# EAGLE design newew (EAGLE 7.6.0)
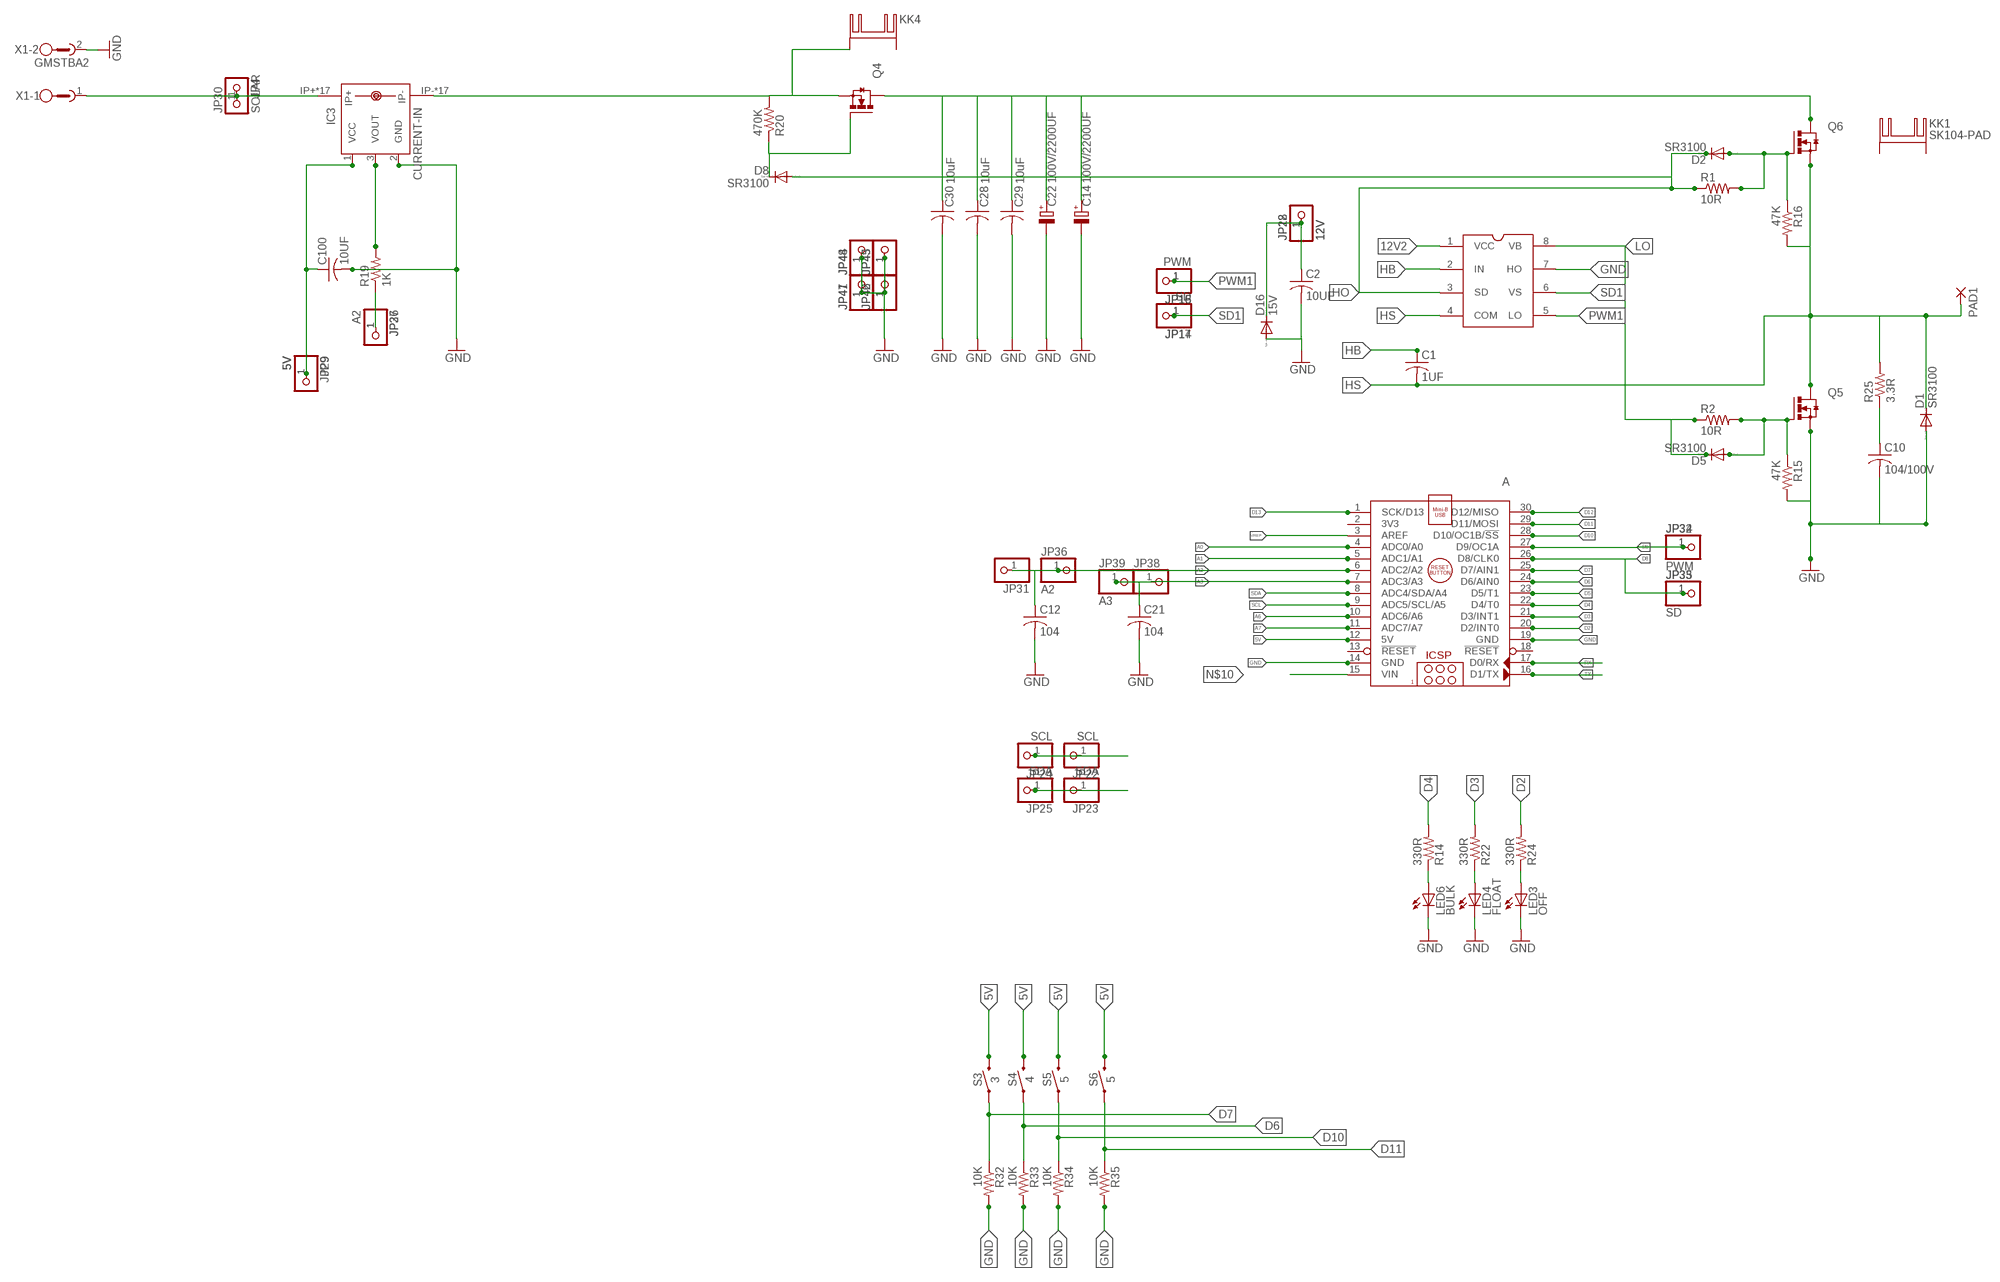
[diagram p0: schematic, sheet 1, part 1 of 2]
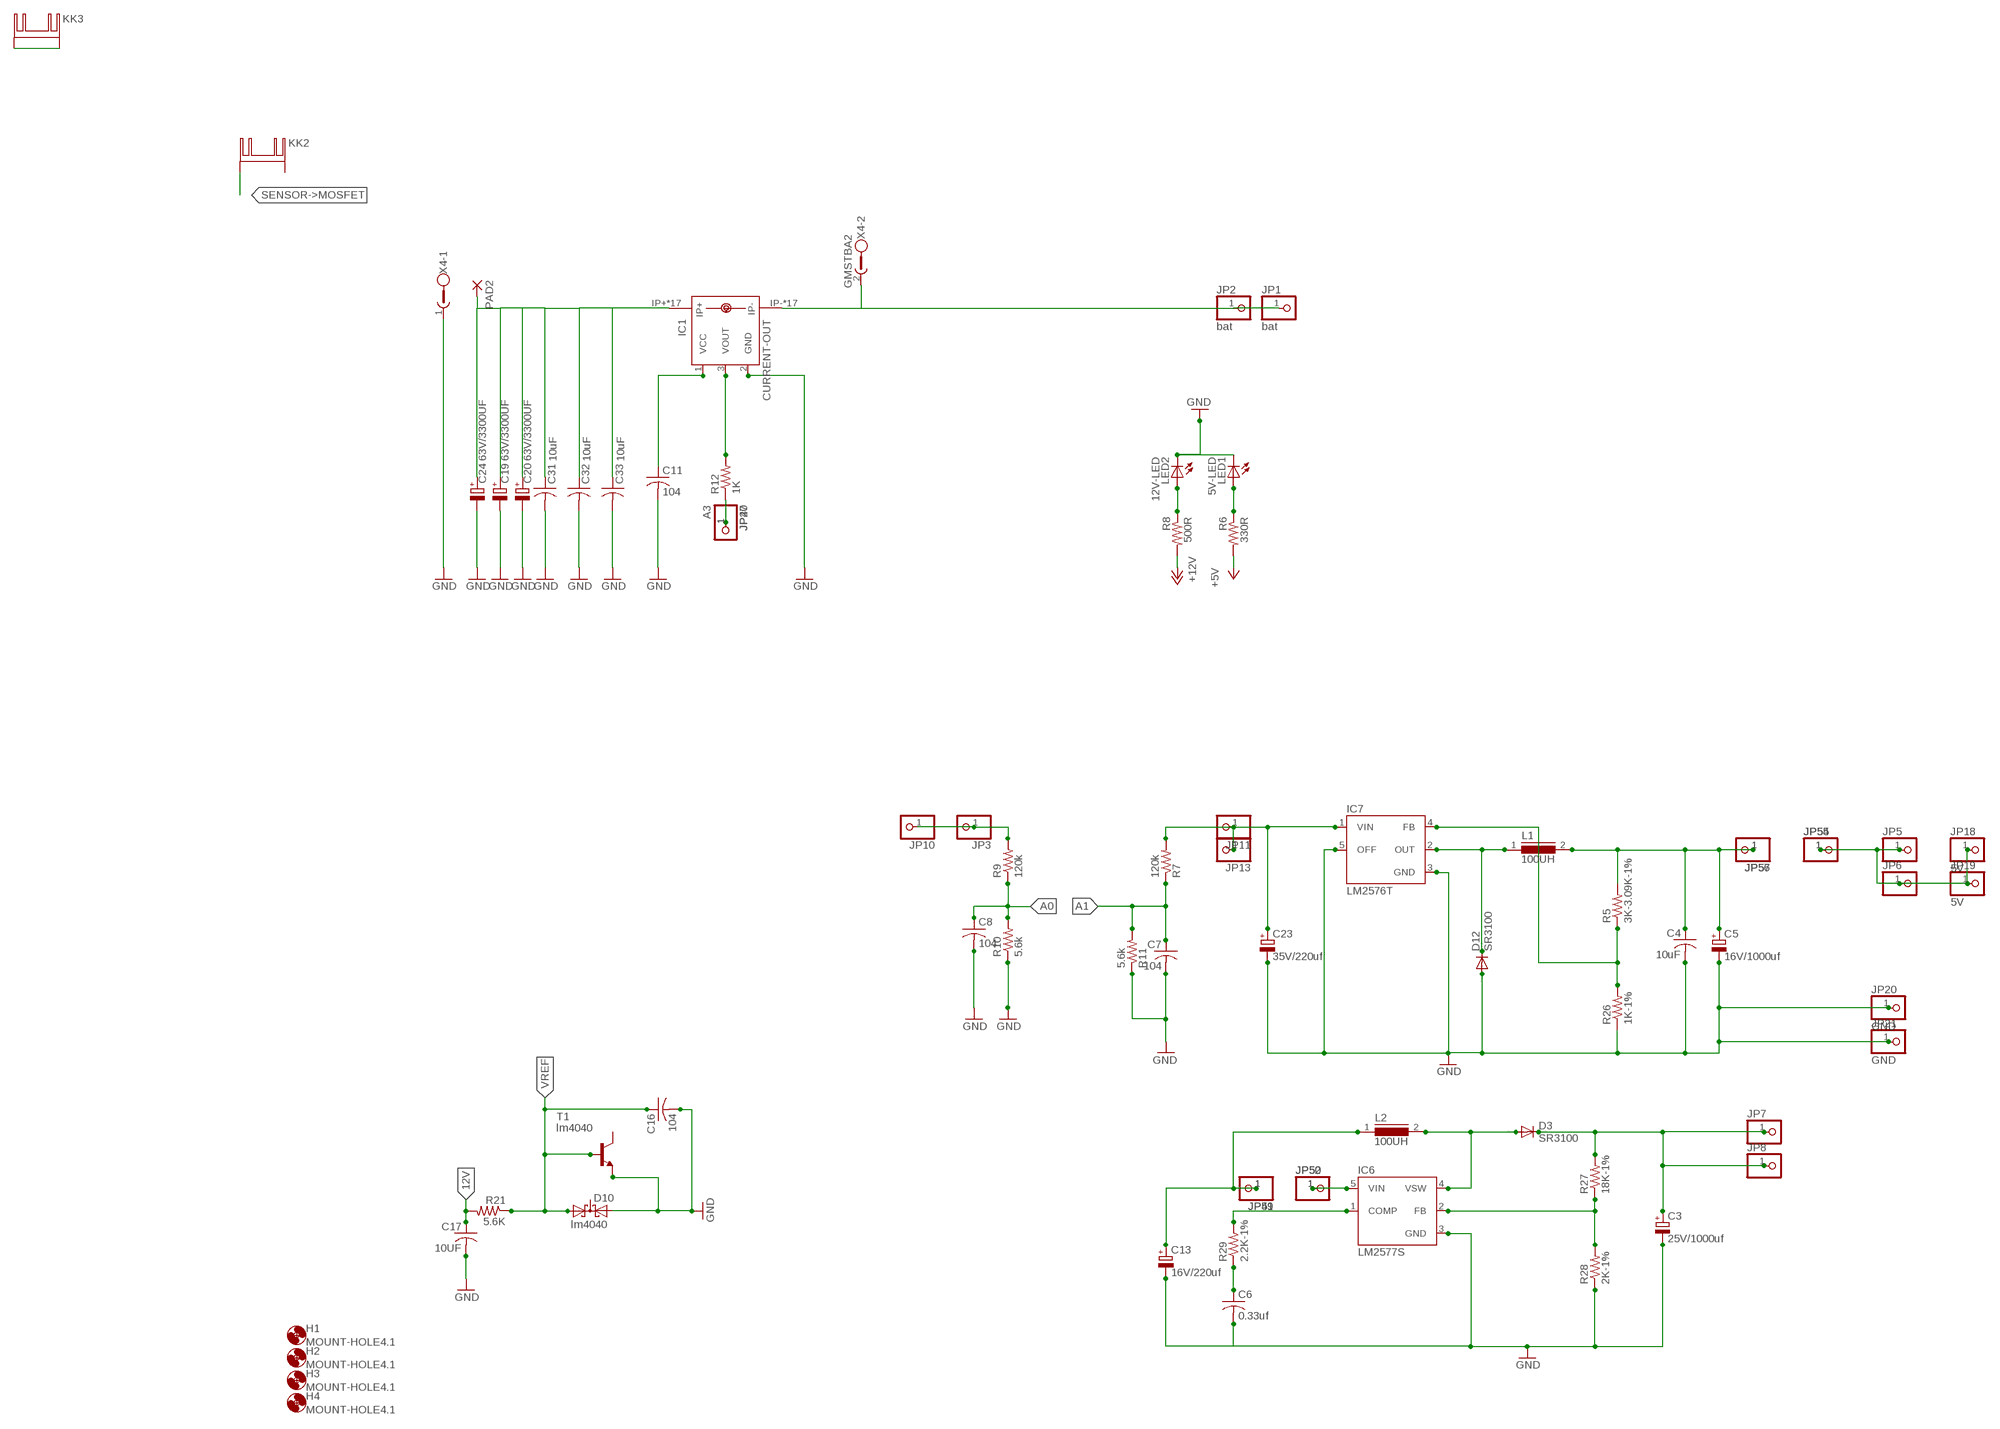
[diagram p1: schematic, sheet 1, part 2 of 2]

## Parts
A  ARDUINO_NANO  [ARDUINO_NANO]
C1  1UF  C-US025-024X044  [C025-024X044]
C2  10UF  C-US025-024X044  [C025-024X044]
C3  25V/1000uf  CPOL-EUE5-8.5  [E5-8,5]
C4  10uF  C-US025-024X044  [C025-024X044]
C5  16V/1000uf  CPOL-EUE5-8.5  [E5-8,5]
C6  0.33uf  C-US025-024X044  [C025-024X044]
C7  104  C-US025-024X044  [C025-024X044]
C8  104  C-US025-024X044  [C025-024X044]
C10  104/100V  C-US075-063X106  [C075-063X106]
C11  104  C-US025-025X050  [C025-025X050]
C12  104  C-US025-030X050  [C025-030X050]
C13  16V/220uf  CPOL-EUE5-8.5  [E5-8,5]
C14  100V/2200UF  CPOL-EUE7.5-18  [E7,5-18]
C16  104  C-US025-024X044  [C025-024X044]
C17  10UF  C-US025-024X044  [C025-024X044]
C19  63V/3300UF  CPOL-EUE7.5-18  [E7,5-18]
C20  63V/3300UF  CPOL-EUE7.5-18  [E7,5-18]
C21  104  C-US025-030X050  [C025-030X050]
C22  100V/2200UF  CPOL-EUE7.5-18  [E7,5-18]
C23  35V/220uf  CPOL-EUE5-8.5  [E5-8,5]
C24  63V/3300UF  CPOL-EUE7.5-18  [E7,5-18]
C28  10uF  C-USC1210K  [C1210K]
C29  10uF  C-USC1210K  [C1210K]
C30  10uF  C-USC1210K  [C1210K]
C31  10uF  C-USC1210K  [C1210K]
C32  10uF  C-USC1210K  [C1210K]
C33  10uF  C-USC1210K  [C1210K]
C100  10UF  C-US025-025X050  [C025-025X050]
D1  SR3100  DIODE-DO27-15  [DO27-15]
D2  SR3100  DIODE-DO41-7.6  [DO41-7.6]
D3  SR3100  DIODE-DO27-15  [DO27-15]
D5  SR3100  DIODE-DO41-7.6  [DO41-7.6]
D8  SR3100  DIODE-DO41-7.6  [DO41-7.6]
D10  lm4040  BAS40-05  [SOT23]
D12  SR3100  DIODE-DO27-15  [DO27-15]
D16  15V  DIODE-DO41-7.6  [DO41-7.6]
H1  MOUNT-HOLE4.1  [4,1]
H2  MOUNT-HOLE4.1  [4,1]
H3  MOUNT-HOLE4.1  [4,1]
H4  MOUNT-HOLE4.1  [4,1]
IC1  CURRENT-OUT  ACS758LCB-100B-PFF-T  [CB-PFF]
IC3  CURRENT-IN  ACS758LCB-100B-PFF-T  [CB-PFF]
IC6  LM2577S  [TO263-5]
IC7  LM2576T  [TO220-5]
JP1  bat  PINHD-1X1  [1X01]
JP2  bat  PINHD-1X1  [1X01]
JP3  PINHD-1X1  [1X01]
JP4  PINHD-1X1  [1X01]
JP5  PINHD-1X1  [1X01]
JP6  PINHD-1X1  [1X01]
JP7  PINHD-1X1  [1X01]
JP8  PINHD-1X1  [1X01]
JP9  5V  PINHD-1X1  [1X01]
JP10  PINHD-1X1  [1X01]
JP11  PINHD-1X1  [1X01]
JP12  12V  PINHD-1X1  [1X01]
JP13  PINHD-1X1  [1X01]
JP14  PINHD-1X1  [1X01]
JP15  PINHD-1X1  [1X01]
JP16  PWM  PINHD-1X1  [1X01]
JP17  SD  PINHD-1X1  [1X01]
JP18  5V  PINHD-1X1  [1X01]
JP19  5V  PINHD-1X1  [1X01]
JP20  GND  PINHD-1X1  [1X01]
JP21  GND  PINHD-1X1  [1X01]
JP22  SCL  PINHD-1X1  [1X01]
JP23  SDA  PINHD-1X1  [1X01]
JP24  SCL  PINHD-1X1  [1X01]
JP25  SDA  PINHD-1X1  [1X01]
JP26  PINHD-1X1  [1X01]
JP27  PINHD-1X1  [1X01]
JP28  12V  PINHD-1X1  [1X01]
JP29  5V  PINHD-1X1  [1X01]
JP30  SOLAR  PINHD-1X1  [1X01]
JP31  PINHD-1X1  [1X01]
JP32  PINHD-1X1  [1X01]
JP33  PINHD-1X1  [1X01]
JP34  PWM  PINHD-1X1  [1X01]
JP35  SD  PINHD-1X1  [1X01]
JP36  A2  PINHD-1X1  [1X01]
JP37  A2  PINHD-1X1  [1X01]
JP38  PINHD-1X1  [1X01]
JP39  A3  PINHD-1X1  [1X01]
JP40  A3  PINHD-1X1  [1X01]
JP41  PINHD-1X1  [1X01]
JP42  PINHD-1X1  [1X01]
JP43  PINHD-1X1  [1X01]
JP44  PINHD-1X1  [1X01]
JP45  PINHD-1X1  [1X01]
JP46  PINHD-1X1  [1X01]
JP47  PINHD-1X1  [1X01]
JP48  PINHD-1X1  [1X01]
JP49  PINHD-1X1  [1X01]
JP50  PINHD-1X1  [1X01]
JP51  PINHD-1X1  [1X01]
JP52  PINHD-1X1  [1X01]
JP54  PINHD-1X1  [1X01]
JP55  PINHD-1X1  [1X01]
JP56  PINHD-1X1  [1X01]
JP57  PINHD-1X1  [1X01]
KK1  SK104-PAD  [SK104-PAD]
KK2  SK104-PAD  [SK104-PAD]
KK3  SK104-PAD  [SK104-PAD]
KK4  SK104-PAD  [SK104-PAD]
L1  100UH  A26GFC  [A26GFC]
L2  100UH  A26GFC  [A26GFC]
LED1  5V-LED  LED3MM  [LED3MM]
LED2  12V-LED  LED3MM  [LED3MM]
LED3  OFF  LED3MM  [LED3MM]
LED4  FLOAT  LED3MM  [LED3MM]
LED6  BULK  LED3MM  [LED3MM]
PAD1  3,81/1,4  [3,81/1,4]
PAD2  3,81/1,4  [3,81/1,4]
Q4  IRF3704L-V  [TO262-V]
Q5  IRF3704L-V  [TO262-V]
Q6  IRF3704L-V  [TO262-V]
R1  10R  R-US_0204/7  [0204/7]
R2  10R  R-US_0204/7  [0204/7]
R5  3K-3.09K-1%  R-US_0204/7  [0204/7]
R6  330R  R-US_0204/7  [0204/7]
R7  120k  R-US_0204/7  [0204/7]
R8  500R  R-US_0204/7  [0204/7]
R9  120k  R-US_0204/7  [0204/7]
R10  5.6k  R-US_0204/7  [0204/7]
R11  5.6k  R-US_0204/7  [0204/7]
R12  1K  R-US_0204/7  [0204/7]
R14  330R  R-US_0204/7  [0204/7]
R15  47K  R-US_0309/10  [0309/10]
R16  47K  R-US_0309/10  [0309/10]
R19  1K  R-US_0204/7  [0204/7]
R20  470K  R-US_0309/10  [0309/10]
R21  5.6K  R-US_0204/7  [0204/7]
R22  330R  R-US_0204/7  [0204/7]
R24  330R  R-US_0204/7  [0204/7]
R25  3.3R  R-US_0309/10  [0309/10]
R26  1K-1%  R-US_0204/7  [0204/7]
R27  18K-1%  R-US_0204/7  [0204/7]
R28  2K-1%  R-US_0204/7  [0204/7]
R29  2.2K-1%  R-US_0204/7  [0204/7]
R32  10K  R-US_0204/7  [0204/7]
R33  10K  R-US_0204/7  [0204/7]
R34  10K  R-US_0204/7  [0204/7]
R35  10K  R-US_0204/7  [0204/7]
S3  3  MOMENTARY-SWITCH-SPST-PTH-6.0MM  [TACTILE_SWITCH_PTH_6.0MM]
S4  4  MOMENTARY-SWITCH-SPST-PTH-6.0MM  [TACTILE_SWITCH_PTH_6.0MM]
S5  5  MOMENTARY-SWITCH-SPST-PTH-6.0MM  [TACTILE_SWITCH_PTH_6.0MM]
S6  5  MOMENTARY-SWITCH-SPST-PTH-6.0MM  [TACTILE_SWITCH_PTH_6.0MM]
T1  lm4040  2N2222  [TO92-EBC-OVAL]
U$2  MIC4102  IR2104S  [IR2104S]
X1  GMSTBA2  [GMSTBA2]
X4  GMSTBA2  [GMSTBA2]

## Nets
5V: A.12(5V) C13.+ JP5.1 JP6.1 JP18.1 JP19.1 JP49.1 JP51.1 JP54.1 JP55.1 L2.1 R6.2 S3.3 S4.3 S5.3 S6.3 ; supply symbol labelled +5V
5V2: C11.1 C100.1 IC1.1(VCC) IC3.1(VCC) JP9.1 JP29.1
12V: C3.+ C17.1 D3.C JP7.1 JP8.1 R8.2 R21.2 R27.2 ; supply symbol labelled +12V
12V2: C2.1 D16.C JP12.1 JP28.1 U$2.1(VCC)
A0: A.4(ADC0/A0) C8.1 R9.1 R10.2
A1: A.5(ADC1/A1) C7.1 R7.1 R11.2
A2: A.6(ADC2/A2) C12.1 JP31.1 JP36.1
A3: A.7(ADC3/A3) C21.1 JP38.1 JP39.1
A6: A.10(ADC6/A6)
A7: A.11(ADC7/A7)
ASDA: C4.1 C5.+ JP56.1 JP57.1 L1.2 R5.2
D2: A.20(D2/INT0) R24.2
D3: A.21(D3/INT1) R22.2
D4: A.22(D4/T0) R14.2
D5: A.23(D5/T1)
D6: A.24(D6/AIN0) R33.1 S4.1
D7: A.25(D7/AIN1) R32.1 S3.1
D8: A.26(D8/CLK0) JP33.1 JP35.1
D9: A.27(D9/OC1A) JP32.1 JP34.1
D10: A.28(D10/OC1B/!SS) R34.1 S5.1
D11: A.29(D11/MOSI) R35.1 S6.1
D12: A.30(D12/MISO)
D13: A.1(SCK/D13)
EW: JP3.1 JP10.1 R9.2
GND: A.14(GND) A.19(GND) C2.2 C3.- C4.2 C5.- C6.2 C7.2 C8.2 C10.2 C11.2 C12.2 C13.- C14.- C16.2 C17.2 C19.- C20.- C21.2 C22.- C23.- C24.- C28.2 C29.2 C30.2 C31.2 C32.2 C33.2 C100.2 D1.A D10.2(A2) D12.A D16.A IC1.2(GND) IC3.2(GND) IC6.3(GND) IC7.3(GND) IC7.5(OFF) JP20.1 JP21.1 JP41.1 JP42.1 JP43.1 JP44.1 JP45.1 JP46.1 JP47.1 JP48.1 LED1.K(C) LED2.K(C) LED3.K(C) LED4.K(C) LED6.K(C) Q5.3(S) R10.1 R11.1 R15.2 R26.1 R28.1 R32.2 R33.2 R34.2 R35.2 T1.E U$2.7(HO) X1.2 X4.1
HB: C1.1 U$2.2(IN)
HO: D2.C D8.A R1.1 U$2.3(SD)
HS: C1.2 D1.C KK3.K1(K) KK3.K2(K) PAD1.1(P) Q5.2(D) Q6.3(S) R16.2 R25.2 U$2.4(COM)
INDUCTOR->SENSOR: C19.+ C20.+ C24.+ C31.1 C32.1 C33.1 IC1.IP+ IC1.IP+@2(IP+) IC1.IP+@3(IP+) IC1.IP+@4(IP+) IC1.IP+@5(IP+) IC1.IP+@6(IP+) IC1.IP+@7(IP+) IC1.IP+@8(IP+) IC1.IP+@9(IP+) IC1.IP+@10(IP+) IC1.IP+@11(IP+) IC1.IP+@12(IP+) IC1.IP+@13(IP+) IC1.IP+@14(IP+) IC1.IP+@15(IP+) IC1.IP+@16(IP+) IC1.IP+@17(IP+) PAD2.1(P)
LO: D5.C R2.1 U$2.8(VB)
N$1: LED6.A R14.1
N$2: D12.C IC7.2(OUT) L1.1
N$3: LED4.A R22.1
N$4: D2.A Q6.1(G) R1.2 R16.1
N$6: C10.1 R25.1
N$7: LED3.A R24.1
N$8: IC3.IP- IC3.IP-@2(IP-) IC3.IP-@3(IP-) IC3.IP-@4(IP-) IC3.IP-@5(IP-) IC3.IP-@6(IP-) IC3.IP-@7(IP-) IC3.IP-@8(IP-) IC3.IP-@9(IP-) IC3.IP-@10(IP-) IC3.IP-@11(IP-) IC3.IP-@12(IP-) IC3.IP-@13(IP-) IC3.IP-@14(IP-) IC3.IP-@15(IP-) IC3.IP-@16(IP-) IC3.IP-@17(IP-) KK4.K1(K) Q4.3(S) R20.2
N$10: A.15(VIN)
N$11: LED1.A R6.1
N$12: IC1.3(VOUT) R12.2
N$13: IC1.IP- IC1.IP-@2(IP-) IC1.IP-@3(IP-) IC1.IP-@4(IP-) IC1.IP-@5(IP-) IC1.IP-@6(IP-) IC1.IP-@7(IP-) IC1.IP-@8(IP-) IC1.IP-@9(IP-) IC1.IP-@10(IP-) IC1.IP-@11(IP-) IC1.IP-@12(IP-) IC1.IP-@13(IP-) IC1.IP-@14(IP-) IC1.IP-@15(IP-) IC1.IP-@16(IP-) IC1.IP-@17(IP-) JP1.1 JP2.1 X4.2
N$14: LED2.A R8.1
N$16: IC3.3(VOUT) R19.2
N$18: IC6.5(VIN) JP50.1 JP52.1
N$24: D8.C Q4.1(G) R20.1
N$25: D5.A Q5.1(G) R2.2 R15.1
N$28: JP26.1 JP37.1 R19.1
N$30: C23.+ IC7.1(VIN) JP11.1 JP13.1 R7.2
N$33: IC7.4(FB) R5.1 R26.2
N$34: D3.A IC6.4(VSW) L2.2
N$36: IC6.2(FB) R27.1 R28.2
N$39: C6.1 R29.1
N$40: IC6.1(COMP) R29.2
PWM1: JP15.1 JP16.1 U$2.5(LO)
RX: A.17(D0/RX)
SCL: A.9(ADC5/SCL/A5) JP22.1 JP24.1
SD1: JP14.1 JP17.1 U$2.6(VS)
SDA: A.8(ADC4/SDA/A4) JP23.1 JP25.1
SDS: JP27.1 JP40.1 R12.1
SENSOR->MOSFET: C14.+ C22.+ C28.1 C29.1 C30.1 KK2.K1(K) Q4.2(D) Q6.2(D)
SOLAR-POSITIVE-BUS: IC3.IP+ IC3.IP+@2(IP+) IC3.IP+@3(IP+) IC3.IP+@4(IP+) IC3.IP+@5(IP+) IC3.IP+@6(IP+) IC3.IP+@7(IP+) IC3.IP+@8(IP+) IC3.IP+@9(IP+) IC3.IP+@10(IP+) IC3.IP+@11(IP+) IC3.IP+@12(IP+) IC3.IP+@13(IP+) IC3.IP+@14(IP+) IC3.IP+@15(IP+) IC3.IP+@16(IP+) IC3.IP+@17(IP+) JP4.1 JP30.1 X1.1
TX: A.16(D1/TX)
VREF: A.3(AREF) C16.1 D10.1(A1) R21.1 T1.B
Unconnected: A.2(3V3) A.13(!RESET) A.18(!RESET) D10.3(C) KK1.K1(K) KK1.K2(K) KK2.K2(K) KK4.K2(K) T1.C

## Library data of the parts
A = ArduinoNanoV30:ARDUINO_NANO: Arduino Nano V3.0 Module Overview: The Arduino Nano is a small, complete, and breadboard-friendly board based on the ATmega328 (Arduino Nano 3.x) or ATmega168 (Arduino Nano 2.x). It has more or less the same functionality of the Arduino Duemilanove, but in a different package. It lacks only a DC power jack, and works with a Mini-B USB cable instead of a standard one. The Nano was designed and is being produced by Gravitech <http://www.gravitech.us/arna30wiatp.html>. General specifications: Item Value Microcontroller Atmel ATmega168 or ATmega328 Operating Voltage (logic level) 5 V Input Voltage (recommended) 7-12 V Input Voltage (limits) 6-20 V Digital I/O Pins 14 (of which 6 provide PWM output) Analog Input Pins 8 DC Current per I/O Pin 40 mA Flash Memory 16 KB (ATmega168) or 32 KB (ATmega328) of which 2 KB used by bootloader SRAM 1 KB (ATmega168) or 2 KB (ATmega328) EEPROM 512 bytes (ATmega168) or 1 KB (ATmega328) Clock Speed 16 MHz Dimensions (Inches) 0.73" x 1.70" Dimensions (mm) 18mm x 45mm Overall height About 9 mm (not including pins) Weigth 5 g Power: The Arduino Nano can be powered via the Mini-B USB connection, 6-20V unregulated external power supply (pin 30), or 5V regulated external power supply (pin 27). The power source is automatically selected to the highest voltage source. Memory: The ATmega168 has 16 KB of flash memory for storing code (of which 2 KB is used for the bootloader); the ATmega328 has 32 KB, (also with 2 KB used for the bootloader). The ATmega168 has 1 KB of SRAM and 512 bytes of EEPROM (which can be read and written with the EEPROM library); the ATmega328 has 2 KB of SRAM and 1 KB of EEPROM. Input and Output: Each of the 14 digital pins on the Nano can be used as an input or output, using pinMode(), digitalWrite(), and digitalRead() functions. They operate at 5 volts. Each pin can provide or receive a maximum of 40 mA and has an internal pull-up resistor (disconnected by default) of 20-50 kOhms. In addition, some pins have specialized functions. Visit Arduino - ArduinoBoardNano <https://www.arduino.cc/en/Main/ArduinoBoardNano>
C1 C2 C4 C6-C8 C10-C12 C16 C17 C21 C28-C33 C100 = resistor:C-US: CAPACITOR, American symbol
C3 C5 C13 C23 = resistor:CPOL-EU: POLARIZED CAPACITOR, European symbol
C14 C19 C20 C22 C24 = rcl:CPOL-EU: POLARIZED CAPACITOR, European symbol
D1-D3 D5 D8 D12 D16 = diode:DIODE-: DIODE
D10 = diode:BAS40-05: Silicon Schottky Diodes General-purpose diode for high-speed switching
H1-H4 = holes:MOUNT-HOLE: MOUNTING HOLE with drill center marker
IC1 IC3 = allegro:ACS758*: Thermally Enhanced, Fully Integrated, Hall Effect-Based Linear Current Sensor with 100 micro Ohm Current Conductor display layer 49 Reference in BRD and place VIAs on circles Source: http://www.allegromicro.com/en/Products/Part_Numbers/0758/0758.pdf; MPN: ACS758LCB-100B-PFF-T; OC_FARNELL: 1718998; OC_NEWARK: 04R7132
IC6 = lm2575:LM2577: National Semiconductor <http://www.national.com> 3.0A Step-Up "Simple Switcher"(c) 3.0A 65V NPN switch, step-up regulator
IC7 = lm2575:LM2576: National Semiconductor <http://www.national.com> 3.0A "Simple Switcher"(c) 52kHz, Vout 1.23-37V (HV: 57V), Vin 40V (HV: 60V), 50µA standby current
JP1-JP52 JP54-JP57 = adafruit:PINHD-1X1: Pin header 1x1 for 0.1" spacing With round pins
KK1-KK4 = heatsink:SK104-PAD: HEATSINK manufacturer Fischer/distributor Buerklin
L1 L2 = inductors:A26GFC: INDUCTOR
LED1-LED4 LED6 = adafruit:LED: LED OSRAM: - CHIPLED LG R971, LG N971, LY N971, LG Q971, LY Q971, LO R971, LY R971 LH N974, LH R974 LS Q976, LO Q976, LY Q976 LO Q996 - Hyper CHIPLED LW Q18S LB Q993, LB Q99A, LB R99A - SideLED LS A670, LO A670, LY A670, LG A670, LP A670 LB A673, LV A673, LT A673, LW A673 LH A674 LY A675 LS A676, LA A676, LO A676, LY A676, LW A676 LS A679, LY A679, LG A679 - Hyper Micro SIDELED® LS Y876, LA Y876, LO Y876, LY Y876 LT Y87S - SmartLED LW L88C, LW L88S LB L89C, LB L89S, LG L890 LS L89K, LO L89K, LY L89K LS L896, LA L896, LO L896, LY L896 - TOPLED LS T670, LO T670, LY T670, LG T670, LP T670 LSG T670, LSP T670, LSY T670, LOP T670, LYG T670 LG T671, LOG T671, LSG T671 LB T673, LV T673, LT T673, LW T673 LH T674 LS T676, LA T676, LO T676, LY T676, LB T676, LH T676, LSB T676, LW T676 LB T67C, LV T67C, LT T67C, LS T67K, LO T67K, LY T67K, LW E67C LS E67B, LA E67B, LO E67B, LY E67B, LB E67C, LV E67C, LT E67C LW T67C LS T679, LY T679, LG T679 LS T770, LO T770, LY T770, LG T770, LP T770 LB T773, LV T773, LT T773, LW T773 LH T774 LS E675, LA E675, LY E675, LS T675 LS T776, LA T776, LO T776, LY T776, LB T776 LHGB T686 LT T68C, LB T68C - Hyper Mini TOPLED® LB M676 - Mini TOPLED Santana® LG M470 LS M47K, LO M47K, LY M47K Source: http://www.osram.convergy.de/
PAD1 PAD2 = wirepad:3,81/1,4: THROUGH-HOLE PAD
Q4-Q6 = transistor-power:IRF3704: SMPS MOSFET HEXFET® Power MOSFET Source: http://www.irf.com/product-info/datasheets/data/irf3704.pdf
R1 R2 R5-R12 R14-R16 R19-R22 R24-R29 R32-R35 = resistor:R-US_: RESISTOR, American symbol
S3-S6 = SparkFun-Switches:MOMENTARY-SWITCH-SPST: Momentary Switch (Pushbutton) - SPST Normally-open (NO) SPST momentary switches (buttons, pushbuttons). Variants PTH-12MM - 12mm square, through-hole Momentary Pushbutton Switch - 12mm Square <https://www.sparkfun.com/products/9190> (COM-09190) PTH-6.0MM, PTH-6.0MM-KIT - 6.0mm square, through-hole Mini Pushbutton Switch <https://www.sparkfun.com/products/97> (COM-00097) KIT package intended for soldering kit's - only one side of pads' copper is exposed. PTH-RIGHT-ANGLE-KIT - Right-angle, through-hole Right Angle Tactile Button <https://www.sparkfun.com/products/10791> - Used on SparkFun BigTime Watch Kit <https://www.sparkfun.com/products/11734> SMD-12MM - 12mm square, surface-mount Tactile Button - SMD (12mm) <https://www.sparkfun.com/products/12993> (COM-12993) Used on SparkFun PicoBoard <https://www.sparkfun.com/products/11888> SMD-4.5MM - 4.5mm Square Trackball Switch Used on SparkFun Blackberry Trackballer Breakout <https://www.sparkfun.com/products/13169> SMD-4.6MMX2.8MM - 4.60mm x 2.80mm, surface mount Used on SparkFun SAMD21 Mini Breakout <https://www.sparkfun.com/products/13664> SMD-5.2MM, SMD-5.2-REDUNDANT - 5.2mm square, surface-mount Mini Pushbutton Switch - SMD <https://www.sparkfun.com/products/8720> (COM-08720) Used on Arduino Pro Mini <https://www.sparkfun.com/products/11114> REDUNDANT package connects both switch circuits together SMD-6.0X3.5MM - 6.0 x 3.5mm, surface mount Momentary Reset Switch SMD <https://www.sparkfun.com/products/8229> (COM-08229) SMD-6.2MM-TALL - 6.2mm square, surface mount Tactile Button - SMD (6mm) <https://www.sparkfun.com/products/12992> Used on SparkFun Digital Sandbox <https://www.sparkfun.com/products/12651> SMD-RIGHT-ANGLE - Right-angle, surface mount Used on SparkFun Block for Intel® Edison - Arduino <https://www.sparkfun.com/products/13036>; PROD_ID: SWCH-08441; SF_SKU: COM-00097
T1 = adafruit:2N2222: NPN TRANSISTOR Big oval pads
U$2 = ir-2104:IR2104S: Half Bridge Mosfet - IGBT driver SOIC
X1 X4 = con-phoenix-762:GMSTBA2: PHOENIX; MF: FARNELL; MPN: 1757242; OC_FARNELL: 3705171; OC_NEWARK: 71C4161

## Board
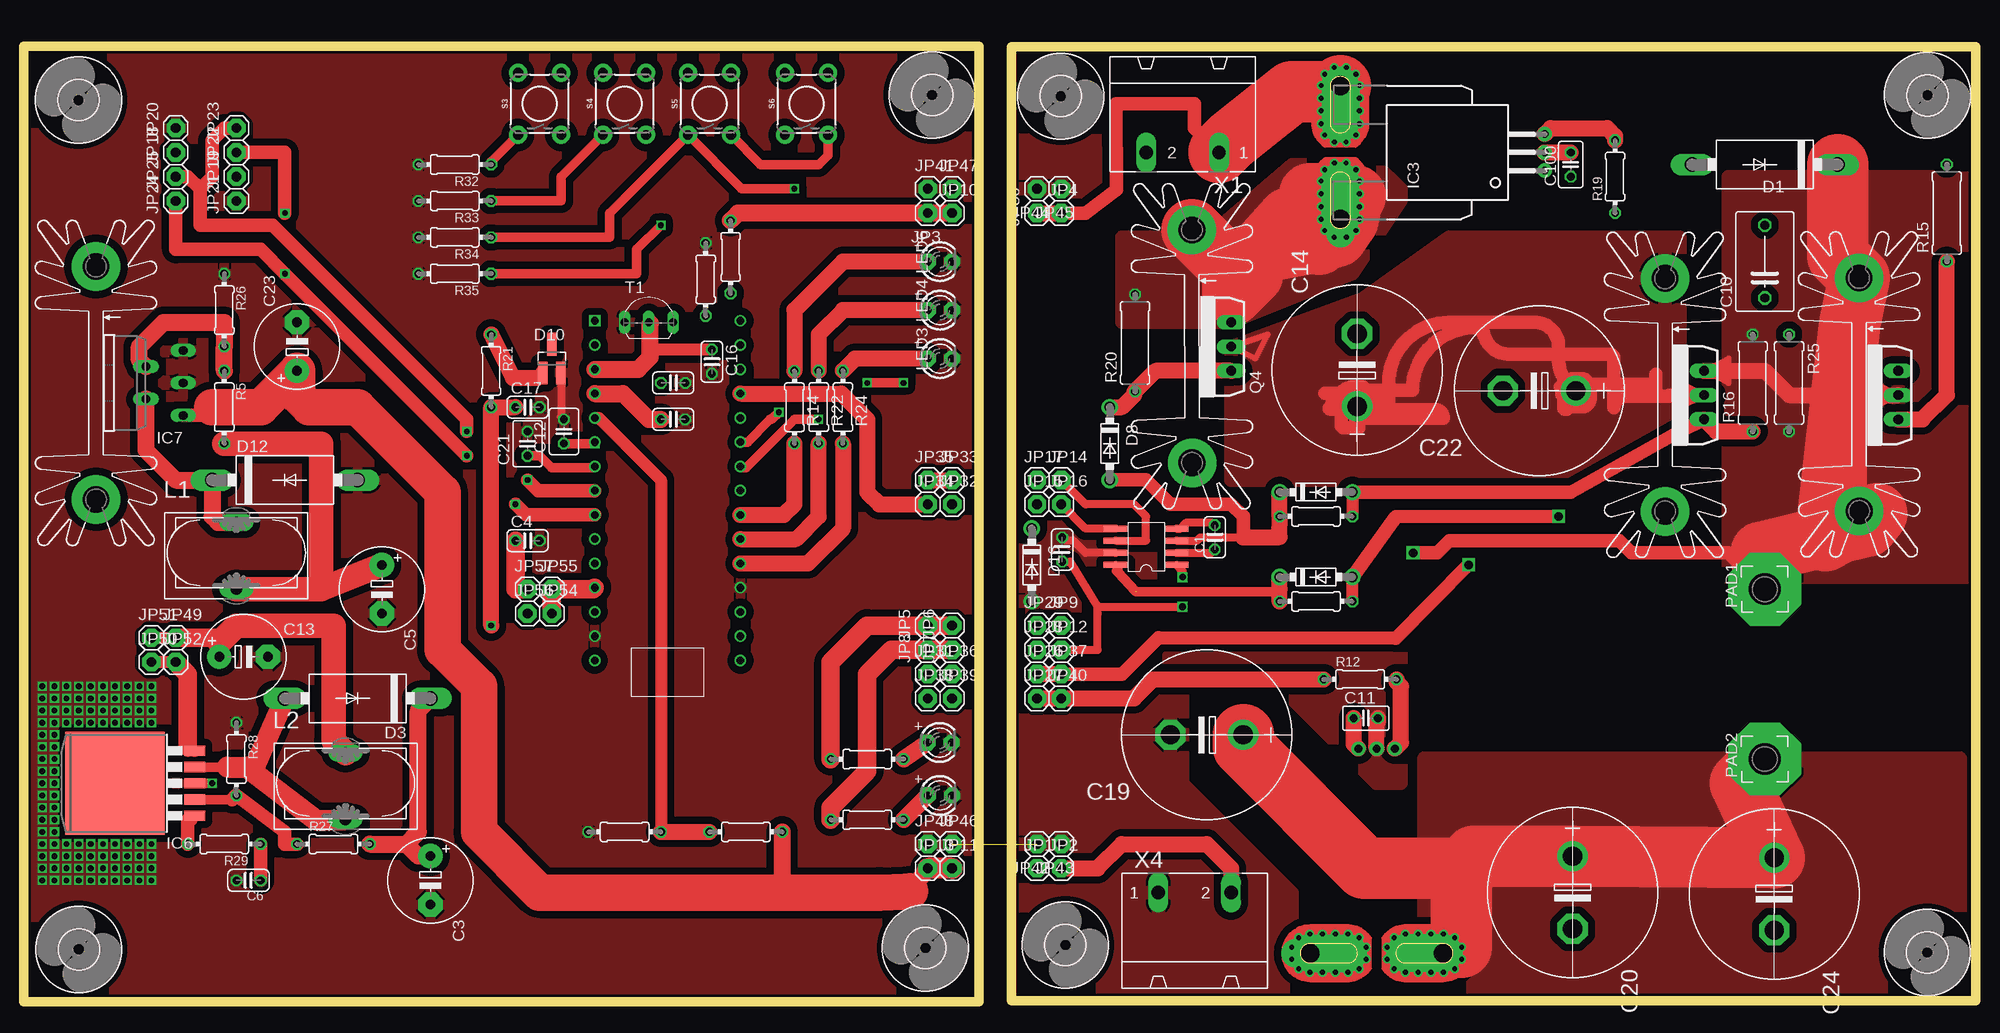
[diagram p2: board, top side]
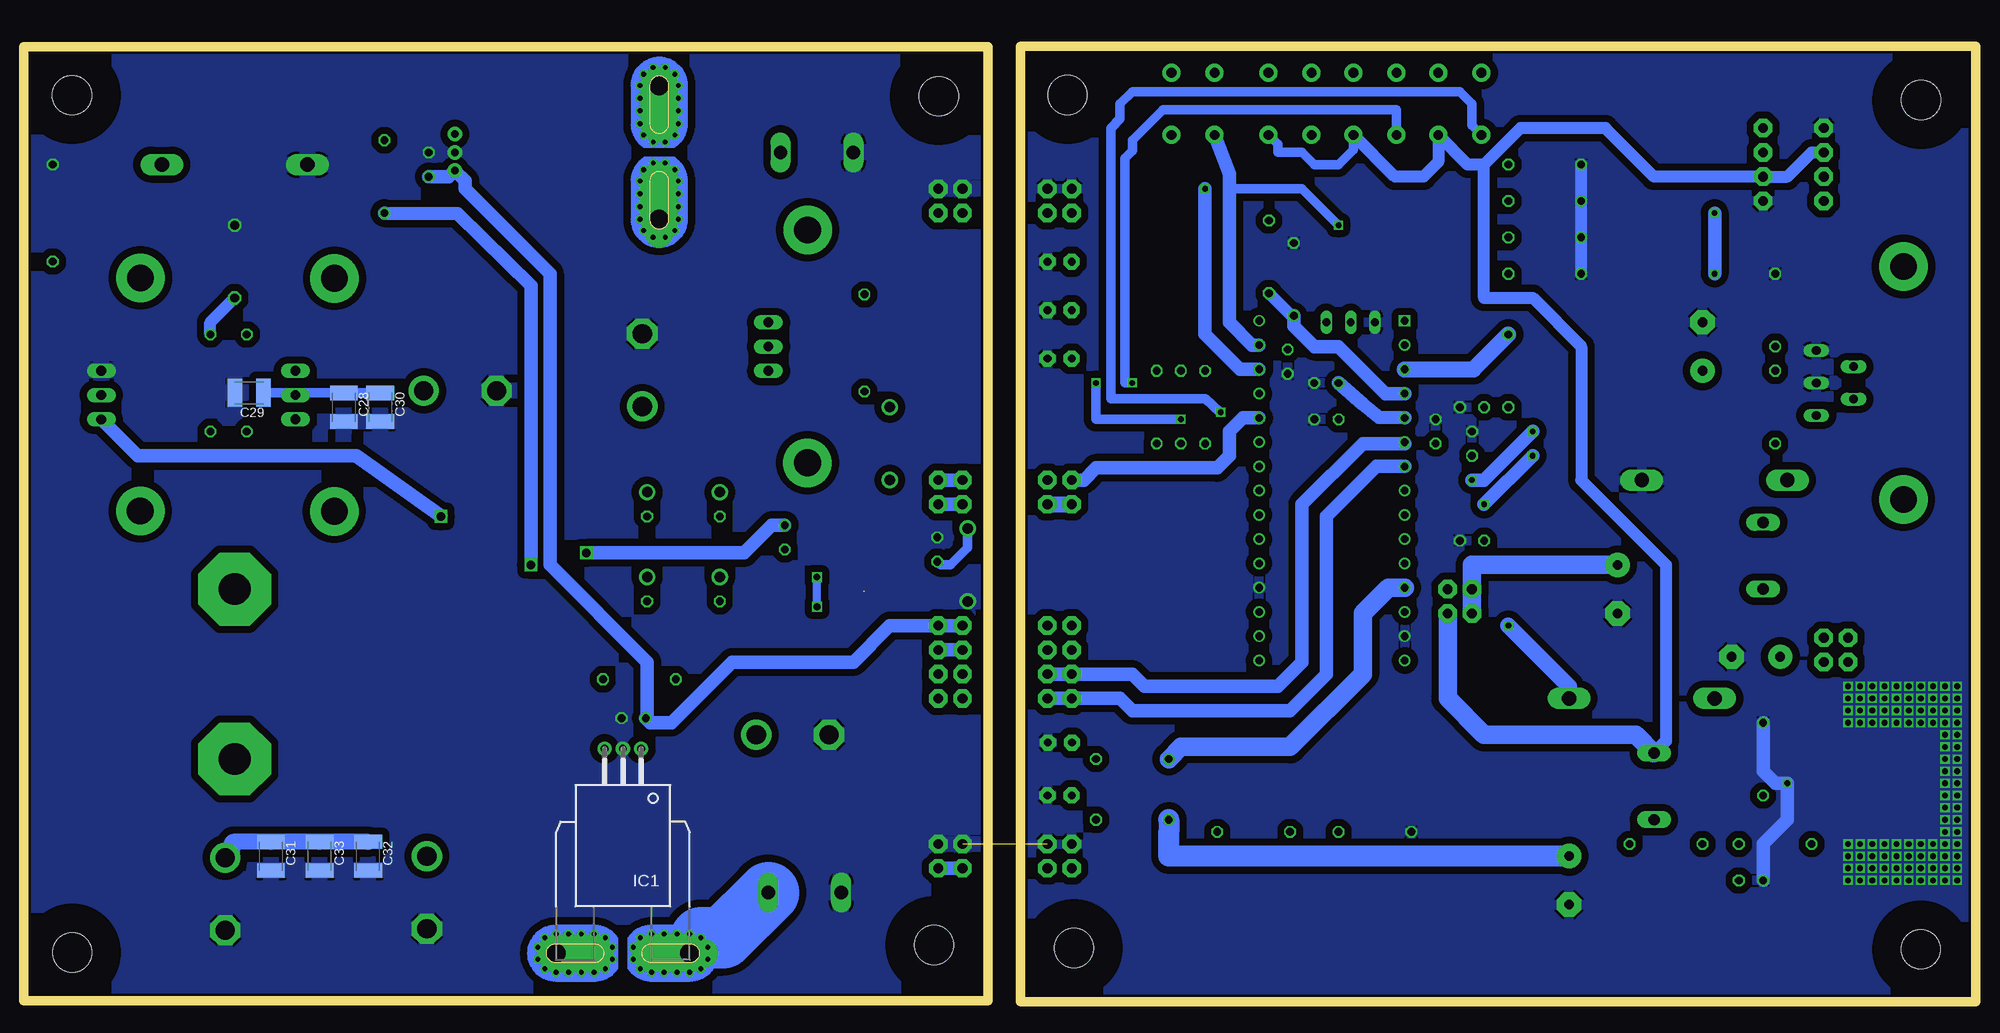
[diagram p3: board, bottom side, seen from below]

Size 204.34 x 100 mm. Coordinates in mm from the lower left corner, seen from the top.
Outline: 0,100 100,100 100,0 0,0 0,100
Outline: 103.39,0.11 103.39,99.95 204.34,99.95 204.34,0.11 103.39,0.11
Copper layers (1*16): Top 0.035mm / dielectric 1.5mm / Bottom 0.035mm
Design rules "oshpark-2layer *": minimum track width 20mil, minimum drill 0.6mm, track to track 30mil, track to pad 30mil, pad to pad 30mil, via to via 30mil, smd to smd 30mil, copper to edge 10mil, drill to drill 10mil, minimum pad ring 7mil, minimum via ring 7mil, stop-mask expansion 2.5mil, vias tented up to drill 6mil, thermal gap 10mil

### Footprints (pad centres in the part's own frame; a part is rotated, then mirrored left to right if it is on the bottom)
ARDUINO_NANO = drill 0.8 square: 1 -20.32,-7.62 | drill 0.8: 2 -17.78,-7.62; 3 -15.24,-7.62; 4 -12.7,-7.62; 5 -10.16,-7.62; 6 -7.62,-7.62; 7 -5.08,-7.62; 8 -2.54,-7.62; 9 0,-7.62; 10 2.54,-7.62; 11 5.08,-7.62; 12 7.62,-7.62; 13 10.16,-7.62; 14 12.7,-7.62; 15 15.24,-7.62; 16 15.24,7.62; 17 12.7,7.62; 18 10.16,7.62; 19 7.62,7.62; 20 5.08,7.62; 21 2.54,7.62; 22 0,7.62; 23 -2.54,7.62; 24 -5.08,7.62; 25 -7.62,7.62; 26 -10.16,7.62; 27 -12.7,7.62; 28 -15.24,7.62; 29 -17.78,7.62; 30 -20.32,7.62
C025-024X044 = drill 0.813 octagon: 1 -1.27,0; 2 1.27,0
E5-8,5 = drill 1.016 pad 2.54: + -2.54,0 | drill 1.016 pad 2.54 octagon: - 2.54,0
C075-063X106 = drill 0.914 octagon: 1 -3.81,0; 2 3.81,0
C025-025X050 = drill 0.813 octagon: 1 -1.27,0; 2 1.27,0
C025-030X050 = drill 0.813 octagon: 1 -1.27,0; 2 1.27,0
E7,5-18 = drill 2 pad 3.15: + -3.81,0 | drill 2 pad 3.15 octagon: - 3.81,0
C1210K = smd 1.5 x 2.9: 1 -1.5,0; 2 1.5,0
DO27-15 = drill 1.499 long: A 7.62,0; C -7.62,0
DO41-7.6 = drill 1.1 pad 1.7: A 3.81,0; C -3.81,0
SOT23 = smd 1 x 2.4: 1 -0.95,-1.5; 2 0.95,-1.5; 3 0,1.5
4,1 = hole 4.1: 0,0
CB-PFF = drill 0.8 pad 1.5: 1 -1.91,-21.4; 2 0,-21.4; 3 1.91,-21.4 | drill 2 pad 4 offset: IP+ 7,0; IP- -7,0 | drill 0.5 pad 0.9: IP+@2 8.89,0.635; IP+@3 8.89,-0.635; IP+@4 8.175,-1.625; IP+@5 7,-2; IP+@6 5.675,-2; IP+@7 4.35,-2; IP+@8 3,-2; IP+@9 1.825,-1.625; IP+@10 1.1,-0.625; IP+@11 1.1,0.625; IP+@12 1.825,1.625; IP+@13 3,2; IP+@14 4.35,2; IP+@15 5.675,2; IP+@16 7,2; IP+@17 8.175,1.625; IP-@2 -8.89,0.635; IP-@3 -8.89,-0.635; IP-@4 -8.175,-1.625; IP-@5 -7,-2; IP-@6 -5.675,-2; IP-@7 -4.325,-2; IP-@8 -3,-2; IP-@9 -1.825,-1.625; IP-@10 -1.1,-0.625; IP-@11 -1.1,0.625; IP-@12 -1.825,1.625; IP-@13 -3,2; IP-@14 -4.325,2; IP-@15 -5.675,2; IP-@16 -7,2; IP-@17 -8.175,1.625 | drill 2 pad 0.813 long: P$1 -6.985,0
TO263-5 = smd 1.067 x 2.159: 1 -3.404,-5.791; 2 -1.702,-5.791; 3 0,-5.791; 4 1.702,-5.791; 5 3.404,-5.791 | smd 10.8 x 10.41: 6 0,2.54
TO220-5 = drill 0.9 long: 1 -3.4,-8.4; 2 -1.7,-4.5; 3 0,-8.4; 4 1.7,-4.5; 5 3.4,-8.4
1X01 = drill 1.016 pad 1.93 octagon: 1 0,0
SK104-PAD = drill 2.8 pad 5.08: K1 -12.187,-0.735; K2 12.196,-0.722
A26GFC = drill 1.194 long: 1 0,3.175; 2 0,-3.81
LED3MM = drill 0.813 pad 1.676 octagon: A -1.27,0; K 1.27,0
3,81/1,4 = drill 3.302 pad 7.62 octagon: 1 0,0
TO262-V = drill 1.016 long: 1 -2.54,0; 2 0,0; 3 2.54,0
0204/7 = drill 0.813 octagon: 1 -3.81,0; 2 3.81,0
0309/10 = drill 0.813 octagon: 1 -5.08,0; 2 5.08,0
TACTILE_SWITCH_PTH_6.0MM = drill 1.016 pad 1.88: 1 -3.251,2.261; 2 3.251,2.261; 3 -3.251,-2.261; 4 3.251,-2.261
TO92-EBC-OVAL = drill 0.813 long: B 0,-1.27; C 2.54,-1.27; E -2.54,-1.27
IR2104S = smd 2.54 x 0.635: 1 -0.635,3.81; 2 -0.635,2.54; 3 -0.635,1.27; 4 -0.635,0; 5 5.715,0; 6 5.715,1.27; 7 5.715,2.54; 8 5.715,3.81
GMSTBA2 = drill 1.397 long: 1 -3.81,5.08; 2 3.81,5.08

### Placement (x,y rotation side)
A  67.39,50.96 270 top
C1  124.68,48.61 90 top
C2  108.71,47.34 90 top
C3  42.57,12.7 270 top
C4  52.73,48.26 0 top
C5  37.49,43.18 270 top
C6  23.52,12.7 180 top
C7  67.97,64.77 0 top
C8  67.97,60.96 0 top
C10  182.27,77.47 90 top
C11  140.5,29.68 0 top
C12  56.54,59.69 90 top
C13  23,36.11 0 top
C14  139.59,66.12 90 top
C16  72.03,66.99 270 top
C17  52.73,62.23 0 top
C19  123.85,27.94 180 top
C20  162.15,11.43 270 top
C21  52.73,58.42 90 top
C22  158.67,63.95 180 top
C23  28.6,68.58 90 top
C24  183.26,11.28 270 top
C28  170.84,62.23 270 bottom
C29  180.74,63.73 180 bottom
C30  167.03,62.23 270 bottom
C31  178.46,15.24 270 bottom
C32  168.3,15.24 270 bottom
C33  173.38,15.24 270 bottom
C100  161.95,87.63 90 top
D1  182.27,87.63 180 top
D2  135.28,53.34 0 top
D3  34.95,31.75 180 top
D5  135.28,44.45 0 top
D8  113.69,58.42 270 top
D10  55.27,67.31 0 top
D12  27.33,54.61 0 top
D16  105.52,45.72 270 top
H1  199.3,94.87 90 top
H2  109.04,5.94 90 top
H3  108.55,94.78 90 top
H4  199.28,5.16 90 top
H5  MOUNT-HOLE4.1  [4,1]  95.08,94.91 90 top
H7  MOUNT-HOLE4.1  [4,1]  5.72,94.38 90 top
H8  MOUNT-HOLE4.1  [4,1]  5.75,5.48 90 top
H9  MOUNT-HOLE4.1  [4,1]  94.38,5.62 90 top
IC1  141.63,5.08 180 bottom
IC3  137.82,88.9 90 top
IC6  12.09,22.86 90 top
IC7  8.28,64.77 90 top
JP1  106.07,13.97 0 top
JP2  108.61,13.97 0 top
JP3  94.64,82.55 180 top
JP4  108.61,82.55 0 top
JP5  94.64,39.37 90 top
JP6  97.18,39.37 90 top
JP7  97.18,36.83 90 top
JP8  94.64,36.83 90 top
JP9  108.61,39.37 0 top
JP10  97.18,82.55 0 top
JP11  97.18,13.97 0 top
JP12  108.61,36.83 0 top
JP13  94.64,13.97 0 top
JP14  108.61,54.61 0 top
JP15  106.07,52.07 0 top
JP16  108.61,52.07 0 top
JP17  106.07,54.61 0 top
JP18  15.9,88.9 90 top
JP19  22.25,86.36 90 top
JP20  15.9,91.44 90 top
JP21  22.25,83.82 90 top
JP22  22.25,88.9 90 top
JP23  22.25,91.44 90 top
JP24  15.9,83.82 90 top
JP25  15.9,86.36 90 top
JP26  106.07,34.29 0 top
JP27  106.07,31.75 0 top
JP28  106.07,36.83 0 top
JP29  106.07,39.37 0 top
JP30  106.07,82.55 90 top
JP31  94.64,34.29 0 top
JP32  97.18,52.07 0 top
JP33  97.18,54.61 0 top
JP34  94.64,52.07 0 top
JP35  94.64,54.61 0 top
JP36  97.18,34.29 0 top
JP37  108.61,34.29 0 top
JP38  94.64,31.75 0 top
JP39  97.18,31.75 0 top
JP40  108.61,31.75 0 top
JP41  94.64,85.09 0 top
JP42  106.07,16.51 180 top
JP43  108.61,16.51 180 top
JP44  106.07,85.09 180 top
JP45  108.61,85.09 180 top
JP46  97.18,16.51 0 top
JP47  97.18,85.09 0 top
JP48  94.64,16.51 0 top
JP49  15.9,38.1 0 top
JP50  13.36,35.56 0 top
JP51  13.36,38.1 0 top
JP52  15.9,35.56 0 top
JP54  55.27,40.64 0 top
JP55  55.27,43.18 0 top
JP56  52.73,40.64 0 top
JP57  52.73,43.18 0 top
KK1  8.28,64.77 270 top
KK2  172.56,63.53 270 top
KK3  192.87,63.57 270 top
KK4  123.02,68.6 270 top
L1  22.24,46.99 0 top
L2  33.68,22.86 0 top
LED1  95.87,27.13 0 top
LED2  95.91,21.59 0 top
LED3  95.91,67.32 0 top
LED4  95.91,72.39 0 top
LED6  95.91,77.47 0 top
PAD1  182.27,43.18 90 top
PAD2  182.27,25.4 90 top
Q4  126.39,68.58 90 top
Q5  196.24,63.5 90 top
Q6  175.92,63.5 90 top
R1  135.28,50.8 0 top
R2  135.28,41.91 0 top
R5  20.98,62.23 270 top
R6  88.29,25.4 180 top
R7  75.59,17.78 0 top
R8  88.29,19.05 180 top
R9  73.98,77.96 90 top
R10  71.38,75.61 270 top
R11  62.89,17.78 0 top
R12  139.9,33.75 0 top
R14  80.67,62.23 270 top
R15  201.32,82.55 90 top
R16  181,64.77 90 top
R19  166.59,86.36 90 top
R20  116.33,68.96 90 top
R21  48.92,66.04 270 top
R22  83.21,62.24 270 top
R24  85.75,62.24 270 top
R25  184.81,64.77 270 top
R26  20.98,72.39 270 top
R27  32.41,16.51 0 top
R28  22.25,25.4 270 top
R29  20.98,16.51 180 top
R32  45.11,87.63 180 top
R33  45.11,83.82 180 top
R34  45.11,80.01 180 top
R35  45.11,76.2 180 top
S3  54,93.98 90 top
S4  62.89,93.98 90 top
S5  71.78,93.98 90 top
S6  81.94,93.98 90 top
T1  65.43,72.39 0 top
U$2  120.04,49.53 180 top
X1  121.31,93.98 180 top
X4  122.58,6.35 0 top

### Tracks (layer width: path | path; a pad name or v marks a point on that pad's centre or on a via)
5V
  Top 1.016: S6.3 84.2,88.62 83.21,87.63 77.14,87.63 S5.3
  Top 1.27: JP51.1 JP49.1
  Top 1.93: JP6.1 JP5.1 88.29,39.37 84.48,35.56 R6.2 | JP54.1 JP55.1 59.61,43.18 A.12 | 20.51,37.63 C13.+ | JP49.1 20.98,38.1
  Top 2.54: 20.51,37.63 20.98,38.1 22.25,39.37 32.41,39.37 32.41,27.3 L2.1
  Bottom 1.016: S4.3 65.15,89.18 66.7,87.63 69.24,87.63 70.51,88.9 73.05,88.9 73.05,89.74 S5.3
  Bottom 1.27: JP18.1 17.17,88.9 19.71,86.36 JP19.1 33.68,86.36 38.76,91.44 47.65,91.44 51.46,87.63 | 51.46,87.63 53.16,87.63 S3.3 56.26,87.91 57.81,86.36 60.78,86.36 S4.3 | L2.1 32.41,27.3 32.41,45.72 41.3,54.61 41.3,68.58 46.38,73.66 51.46,73.66 51.46,87.63
  Bottom 1.778: R6.2
  Bottom 1.93: A.12 61.46,43.34 64.16,40.64 64.16,34.29 71.78,26.67 83.21,26.67 R6.2 | JP54.1 55.27,31.75 51.46,27.94 35.59,27.94 L2.1
5V2
  Top 1.676: IC1.1 139.23,26.97 C11.1
  Bottom 1.422: JP29.1 JP9.1 113.69,39.37 117.5,35.56 130.2,35.56 136.55,29.21 138.75,29.21 C11.1 139.09,29.82 139.09,35.56 149.25,45.72 149.25,76.2 158.14,85.09 158.14,85.91 IC3.1 159.85,86.36 C100.1
12V  (via drill 0.6)
  Top 1.676: v48.92,39.37 R21.2 C17.1
  Top 1.778: R27.2 40.03,16.51 | 40.03,16.51 41.3,17.78 41.3,30.48 D3.C | C3.+ 41.29,15.25 40.03,16.51 | R8.2
  Top 1.93: R8.2 84.48,20.32 88.29,24.13 88.29,34.29 90.83,36.83 JP8.1 JP7.1
  Bottom 0.813: C17.1
  Bottom 1.676: D3.C 42.57,33.02 v48.92,39.37
  Bottom 1.778: 75.59,15.25 75.59,15.24 | 84.48,17.78 R8.2
  Bottom 2.184: C3.+ 75.59,15.25 | 75.59,15.24 84.48,15.24 84.48,17.78 R8.2
12V2  (via drill 0.7)
  Top 0.813: C2.1 109.53,46.07 112.41,41.35 | 112.41,41.35 v121.31,41.34 | v121.31,44.45 121.31,45.08 U$2.1 | JP12.1 112.42,36.83 112.42,40.64 112.41,41.35
  Bottom 0.813: v121.31,41.34 v121.31,44.45
  Bottom 1.016: D16.C 105.52,47.54 107.34,45.72 108.36,45.72 C2.1
  Bottom 1.422: JP28.1 JP12.1
A0
  Top 1.778: A.4 62.73,63.66 65.43,60.96 C8.1
  Bottom 1.27: R10.2 71.63,71.8 R9.1
  Bottom 1.422: R10.2 71.38,70.72 69.24,68.58 66.74,68.58 61.81,63.66 A.4
A1
  Top 1.27: A.5 60.19,61.12 66.7,54.61 R11.2
  Top 1.676: R11.2 R7.1
  Bottom 1.422: C7.1 64.16,62.55 62.48,61.16 A.5
A2  (via drill 0.6 pad 0.6)
  Top 1.016: 59.61,58.42 A.6 v59.77,58.42 C12.1
  Bottom 1.422: v59.77,58.42 64.16,58.42 70.51,52.07 70.51,35.56 73.05,33.02 87.02,33.02 88.29,34.29 JP31.1 JP36.1
A3
  Top 1.016: A.7 59.61,55.88 55.27,55.88 54,57.15 C21.1
  Bottom 1.422: A.7 62.73,56.04 67.97,50.8 67.97,34.29 71.78,30.48 88.29,30.48 89.56,31.75 JP38.1 JP39.1
ASDA
  Top 1.93: C4.1 51.46,43.18 JP57.1
  Top 2.54: L1.2 29.86,43.18 31.14,43.18 | 31.14,43.18 C5.+ | R5.2 31.14,58.42 31.14,43.18
  Bottom 1.93: C5.+ 52.73,45.72 JP57.1 JP56.1
D2
  Top 1.676: A.20 82.1,45.88 85.75,49.53 R24.2
D3
  Top 1.676: A.21 80.83,48.42 83.21,50.8 R22.2
D4
  Top 1.676: A.22 79.56,50.96 80.67,52.07 R14.2
D6  (via drill 0.6)
  Top 1.016: v88.29,64.77 v92.1,64.77 | v83.21,60.96 80.67,60.96 75.59,55.88 75.17,55.88 A.24 | R33.1 56.26,83.82 56.26,86.36 S4.1
  Bottom 1.016: S4.1 60.63,91.72 60.64,93.36 85.1,93.36 88.29,90.17 88.29,89.06 89.05,88.3 89.08,66.62 89.08,64.77 v88.29,64.77 | v83.21,60.96 92.1,60.96 v92.1,64.77
D7  (via drill 0.6)
  Top 1.016: A.25 75.75,58.58 78.13,60.96 78.3,60.96 v79.04,61.7 | R32.1 48.92,87.91 S3.1
  Bottom 0.406: v79.04,61.7 79.13,61.7
  Bottom 1.016: S3.1 52.73,91.72 52.73,93.98 54,95.25 88.29,95.25 89.56,93.98 89.56,92.42 90.54,91.44 90.52,63.13 80.65,63.13 79.13,61.7
D8
  Top 1.676: JP35.1 JP33.1
  Bottom 1.422: A.26 76.7,61.12 78.13,59.69 78.13,57.15 79.4,55.88 92.1,55.88 93.37,54.61 JP35.1
D9
  Top 1.676: A.27 85.59,63.66 88.29,60.96 88.29,53.34 89.56,52.07 JP34.1
  Bottom 1.676: JP32.1 JP34.1
D10  (via drill 0.6)
  Top 1.016: R34.1 61.34,80.01 61.34,82.55 S5.1 75.16,85.09 v80.67,85.09
  Bottom 1.422: A.28 77.02,66.2 80.67,69.85 v80.67,85.09
D11  (via drill 0.6)
  Top 1.016: R35.1 64.16,76.2 64.16,78.74 v66.7,81.28
  Bottom 1.016: v66.7,81.28 70.51,85.09 78.13,85.09
  Bottom 1.422: A.29 75.75,68.74 78.13,71.12 78.13,85.09 78.13,86.64 S6.1
EW
  Top 1.778: JP10.1 JP3.1 74.76,82.55 R9.2
GND  (via drill 0.6)  (1 unrouted)
  Top 0.762: 56.22,61.28 56.5,61.26 C12.2
  Top 0.813: D10.2 56.22,61.28 | U$2.7 111.15,46.99 109.88,48.26 109.05,48.26 C2.2
  Top 1.016: IC6.3 v19.71,22.86
  Top 1.676: IC3.2 C100.2 | IC1.2 141.63,29.21 141.77,29.35 C11.2
  Bottom 1.27: R35.2 R34.2 R33.2 R32.2
  Bottom 1.422: R28.1 22.25,24.13 20.98,22.86 v19.71,22.86 19.71,19.05 22.25,16.51 C6.2
  other vias: 9.55,16.51 3.2,20.32 5.74,16.51 3.2,17.78 3.2,24.13 13.36,15.24 12.09,15.24 10.82,15.24 9.55,15.24 8.28,15.24 5.74,15.24 4.47,15.24 3.2,15.24 1.93,15.24 7.01,15.24 13.36,16.51 12.09,16.51 10.82,16.51 8.28,16.51 7.01,16.51 4.47,16.51 3.2,16.51 1.93,16.51 1.93,17.78 3.2,19.05 1.93,19.05 5.74,30.48 4.47,31.75 12.09,30.48 13.36,29.21 12.09,29.21 10.82,12.7 12.09,12.7 1.93,20.32 1.93,21.59 3.2,21.59 1.93,22.86 5.74,13.97 4.47,30.48 3.2,29.21 3.2,22.86 4.47,29.21 3.2,27.94 7.01,13.97 9.55,12.7 8.28,12.7 9.55,13.97 8.28,13.97 4.47,12.7 3.2,12.7 1.93,12.7 1.93,24.13 1.93,25.4 3.2,25.4 5.74,12.7 1.93,13.97 3.2,13.97 4.47,13.97 10.82,13.97 13.36,12.7 12.09,13.97 7.01,12.7 3.2,26.67 1.93,26.67 1.93,27.94 13.36,13.97 9.55,29.21 8.28,29.21 7.01,29.21 5.74,29.21 1.93,29.21 1.93,30.48 3.2,30.48 7.01,30.48 8.28,30.48 9.55,30.48 10.82,30.48 13.36,30.48 13.36,31.75 10.82,31.75 12.09,31.75 9.55,33.02 8.28,31.75 8.28,33.02 5.74,33.02 12.09,33.02 7.01,33.02 7.01,31.75 5.74,31.75 10.82,33.02 4.47,33.02 3.2,31.75 13.36,33.02 1.93,31.75 1.93,33.02 3.2,33.02 9.55,31.75 10.82,29.21
  pour Bottom: -0.61,100.33 99.72,100.33 99.72,0 -0.61,0
  pour Top: 14.63,8.89 14.63,35.56 0.66,35.56 0.66,8.89
  pour Top: -0.61,100.33 99.72,100.33 99.72,0 -0.61,0
  pour Bottom: 103.53,100.33 205.13,100.33 205.13,0 103.53,0
  pour Top: 103.53,100.33 103.53,-1.27 132.74,0 132.74,11.43 121.31,22.86 121.31,33.02 131.47,33.02 141.63,22.86 144.17,22.86 144.17,50.8 120.04,50.8 120.04,68.58 112.42,68.58 112.42,82.55 112.42,100.33
HB
  Top 0.813: U$2.2 124.33,46.99 C1.1
HO
  Top 0.813: U$2.3 122.83,48.26 123.18,48.61 127.66,48.61 | 131.5,50.92 D2.C | 130.2,48.61 131.46,48.63
  Top 1.422: D8.A 117.5,54.61 120.04,52.07 126.39,52.07 127.66,50.8 127.66,48.61
  Top 1.676: 127.66,48.61 131.46,48.63 131.5,50.92 | R1.1 D2.C
HS  (via drill 0.9)
  Top 0.61: Q6.3 178.46,67.31 178.46,64.77 Q6.3 | Q5.2 193.7,64.77 193.7,62.23 Q5.2
  Top 0.813: U$2.4 121.08,49.53 121.73,50.18 124.38,50.18 C1.2
  Top 1.422: Q5.2 | Q5.2 | v145.44,46.99 147.98,46.99 149.25,48.26 167.03,48.26 168.3,46.99 178.46,46.99 PAD1.1
  Top 1.676: Q6.3 182.27,66.04 184.81,63.5 192.43,63.5 | 192.43,63.5 Q5.2 | KK3.K2 192.15,63.22 192.43,63.5 | KK3.K1 192.14,63.79 192.43,63.5
  Top 6.452: PAD1.1 181.91,47.03 192.96,49.77 193.97,51.1 188.62,48.26 191.16,70.97 KK3.K1 189.89,78.01 D1.C
  Bottom 1.422: C1.2 126.04,49.88 128.93,46.99 v145.44,46.99
  pour Top: 178.46,44.45 178.46,86.36 203.86,86.36 203.86,44.45
INDUCTOR->SENSOR
  Top 6.452: IC1.IP+@3 150.52,13.97 | PAD2.1 179.73,22.86 C24.+ C20.+ 151.79,15.24 150.52,13.97 | C19.+ 127.66,26.67 140.36,13.97 150.52,13.97
  Bottom 1.676: C32.1 C33.1 C31.1 182.45,16.74 182.55,16.64 182.55,15.79 C24.+
  pour Top: 146.71,1.27 146.71,25.4 202.59,25.4 202.59,1.27
LO  (1 unrouted)
  Top 0.61: 131.49,42.91 131.47,43.18
  Top 0.813: U$2.8 114.33,45.08 116.43,42.93
  Top 1.016: 131.49,42.91 116.43,42.93 | 114.55,45.4 114.55,44.93 116.37,42.95
  Top 1.676: R2.1 131.47,43.18 D5.C
N$1
  Top 1.676: LED6.A 85.75,77.47 80.67,72.39 R14.1
N$2
  Top 1.778: IC7.2 12.78,57.73 15.9,54.61 D12.C 19.71,50.8 20.34,50.17 L1.1
N$3
  Top 1.676: LED4.A 85.75,72.39 83.21,69.85 R22.1 | R22.1
N$4
  Top 1.27: D2.A R1.2
  Top 1.422: Q6.1 173.38,59.69 161.95,53.34 149.25,53.34 141.63,53.34 D2.A
  Top 1.676: Q6.1 177.19,59.69 R16.1
N$6
  Bottom 1.27: R25.1 184.81,71.12 C10.1
N$7
  Top 1.676: LED3.A 87.02,67.31 R24.1
N$8
  Top 6.452: IC3.IP-@16 135.82,79.56 135.58,79.31 135.58,83.66 134.66,84.58 135.19,84.58 137.79,81.98 132.38,81.98 129.95,79.3 131.89,79.56 132.82,79.78 136.3,82.61 139.39,84.37 138.95,83.4 138.6,81.81 137.45,80.14 135.33,79.52 128.64,78.24 128.64,76.1 126.58,74.05 126.58,76.5 KK4.K1
  pour Top: 114.96,71.12 114.96,80.01 123.85,80.01 132.74,87.63 141.63,87.63 144.17,85.09 144.17,83.82 139.09,76.2 126.39,71.12
N$11
  Top 1.778: LED1.A R6.1
N$12
  Top 1.676: IC1.3 144.17,27.11 144.17,33.02 143.71,33.48 R12.2
N$13
  Top 1.676: JP2.1 112.42,13.97 114.96,16.51 123.85,16.51 126.39,13.97 X4.2
  Bottom 1.422: JP1.1 JP2.1
  Bottom 6.452: IC1.IP-@4 131.12,6.71 X4.2
N$14
  Top 1.778: LED2.A R8.1 | R8.1
N$16
  Top 1.676: IC3.3 159.85,91.44 165.76,91.44 166.59,90.61 R19.2
N$18
  Top 0.813: 17.17,26.67 17.17,26.26
  Top 1.27: IC6.5 17.17,26.26 | JP52.1 JP50.1
  Top 1.93: JP52.1 17.17,34.29 17.17,26.67
N$24
  Top 1.676: Q4.1 118.5,66.04 R20.1 116.23,63.77 116.23,63.5 114.96,62.23 D8.C
N$25  (via drill 0.9)
  Top 1.27: R2.2 D5.A
  Top 1.422: D5.A 143.65,50.76 v160.68,50.8
  Top 1.676: Q5.1 198.78,60.96 201.32,63.5 R15.1
  Bottom 1.422: Q5.1 192.43,57.15 169.57,57.15 v160.68,50.8
N$28  (via drill 0.9)
  Top 1.422: v151.26,45.72 143.63,38.07 143.6,38.06 118.77,38.1 114.96,34.29 JP37.1
  Top 1.676: JP37.1 JP26.1
  Bottom 1.422: R19.1 158.93,82.48 151.26,74.93 v151.26,45.72
N$30
  Top 1.422: IC7.1 18.85,61.37 19.71,62.23
  Top 1.778: 92.76,11.54 JP13.1 | R7.2 79.4,11.43
  Top 2.184: JP11.1 JP13.1
  Top 3.81: 19.71,62.23 24.79,62.23 C23.+ 28.6,63.5 29.87,62.23 34.95,62.23 43.84,53.34 43.84,36.83 47.65,33.02 47.65,17.78 54,11.43 79.4,11.43 89.56,11.43 92.31,11.49 92.76,11.54
N$33
  Top 1.778: R5.1 R26.2 20.98,71.12 14.63,71.12 12.09,68.58 12.09,67.16 IC7.4
N$34
  Top 1.016: IC6.4 21.34,24.56
  Top 1.422: 24.09,24.54 21.34,24.56
  Top 2.184: 21.34,24.56 23.33,24.56 30.59,19 L2.2 | D3.A 24.09,24.54
N$36
  Top 1.016: IC6.2 21.82,21.16
  Top 1.422: 21.82,21.16 R28.2 27.33,17.78 27.33,16.51 R27.1
N$39
  Top 1.422: C6.1 R29.1
N$40
  Top 1.016: 17.48,19.05 IC6.1
  Top 1.422: R29.2 17.17,19.05 17.48,19.05
PWM1
  Top 0.813: U$2.5 111.15,49.53 JP16.1
  Bottom 1.422: JP15.1 JP16.1
SCL  (via drill 0.6)
  Top 1.422: A.9 52.57,50.96 v51.46,52.07 | v46.38,57.15 v27.33,76.2 24.79,78.74 15.9,78.74 JP24.1 | JP22.1 27.33,88.9 v27.33,82.55
  Bottom 1.422: v51.46,52.07 v46.38,57.15 | v27.33,82.55 v27.33,76.2
SD1
  Top 0.813: U$2.6 117.5,48.26 117.5,50.8 116.23,52.07 111.15,52.07 JP14.1
  Bottom 1.422: JP17.1 JP14.1
SDA  (via drill 0.6)
  Top 1.422: A.8 53.84,53.5 v52.73,54.61 | v46.38,59.69 46.38,60.96 26.06,81.28 18.44,81.28 18.44,85.09 | 18.44,85.09 17.17,86.36 JP25.1 | JP23.1 20.98,91.44 19.71,90.17 19.71,86.36 18.44,85.09
  Bottom 1.422: v52.73,54.61 51.46,54.61 v46.38,59.69
SDS
  Top 1.676: JP27.1 JP40.1 116.23,31.75 118.23,33.75 R12.1
SENSOR->MOSFET  (1 unrouted)
  Top 0.61: Q4.2 130.2,69.85 128.93,67.31 Q4.2 | Q6.2 173.38,64.77 173.38,62.23 Q6.2
  Top 1.422: 170.84,65.68 170.84,63.5 arc90 169.69,64.65 163.69,64.65 arc90 163.14,65.2 162.04,65.2 arc-90 161.89,65.05 161.74,65.05 arc-90 161.08,64.39 160.86,64.39 arc-90 161.01,64.24 161.01,63.54 arc-90 161.23,63.32 161.23,62.15 arc90 161.34,62.04 161.52,62.04 arc-90 161.74,62.26 163.06,62.26 arc90 163.98,63.18 163.98,63.8 arc-90 160.68,67.11 160.68,68.58 arc90 158.14,71.12 149.25,71.12 arc90 142.9,64.77 142.9,62.23 arc90 142.33,62.8 140.94,62.8 arc90 140.81,62.92 140.3,62.92 arc90 140.18,63.05 139.98,63.05 arc90 139.41,63.62 138.65,63.62 arc-90 138.97,63.94 139.86,63.94 arc90 140.43,63.37 140.68,63.37 arc90 141.45,62.61 141.7,62.61 arc90 139.79,60.7 139.79,60.19 arc-90 139.67,60.06 138.27,60.06 arc-90 137.95,60.38 137.95,61.78 arc90 138.4,62.23 138.4,63.37 arc90 138.91,62.86 139.09,62.86 arc-90 139.41,62.54 139.41,61.08 141.76,61.08 | 141.76,61.08 148.62,61.08 arc90 147.74,61.97 138.97,61.97 arc90 139.22,61.72 141.51,61.72 arc-90 141.76,61.46 141.76,61.08 | 141.76,61.08 arc-90 140.24,62.61 140.24,62.99 arc90 139.54,63.69 136.24,63.69 arc-90 137.13,62.8 137.13,62.03 arc-90 139.48,64.39 140.18,64.39 arc-90 137.95,62.16 136.68,62.16 arc90 136.81,62.03 136.87,62.03 arc-90 138.84,64.01 145.38,64.01 arc-90 151.93,70.55 152.75,70.55 arc90 155.55,67.76 166.03,67.76 arc-90 166.48,67.31 166.48,62.16 arc-90 167.68,63.37 172.26,63.37 arc-90 172.39,63.5 Q6.2
  Bottom 1.016: C30.1 C29.1 C28.1 175.69,63.73 Q6.2
  pour Top: 126.39,54.61 126.39,68.58 140.36,73.66 149.25,80.01 173.38,80.01 173.38,54.61
SOLAR-POSITIVE-BUS
  Top 1.422: JP4.1 111.15,82.55 114.4,85 114.35,94 122.58,93.98 122.58,91.44 X1.1
  Top 1.676: JP30.1 JP4.1
  Top 6.452: X1.1 126.39,90.17 132.74,95.25 137.17,95.25 IC3.IP+
VREF
  Top 0.813: 65.58,70.97 T1.B
  Top 1.016: 53.74,65.29 54.09,66.04 D10.1
  Top 1.27: C16.1 65.89,68.26 65.58,68.58
  Top 1.676: 53.74,65.29 51.19,65.29 R21.1
  Top 1.778: A.3 64.32,66.2 65.58,67.46 65.58,68.58 65.58,70.97
  Bottom 1.676: A.3 52.57,66.2 R21.1

### Text on the board
tValues: TOP | ADD | SUB | SAVE | S/R | SOL- | SOL+ | GND | GND | SOLAR | SOLAR | A0 V-SOLAR | OPEN IF / FIXED REG | CLOSED IF / FIXED REG | A-BAT | MIC4102 | 12V/EN | 5V | 12V | EN | EN | EN | AMP-SOL | EN | AMP-BAT | 5V OUT/ENMCU | AMP-SOL | AMP-BAT | OPEN IF / FIXED REG | A1 V-BAT | GND | GND | BAT- | BAT+ | BATTERY | BATTERY | BOT | CLOSED IF / FIXED REG | 22K = 14.76Volts
bValues: JUMPER-GND | JUMPER-GND | JUMPER-GND | JUMPER-GND